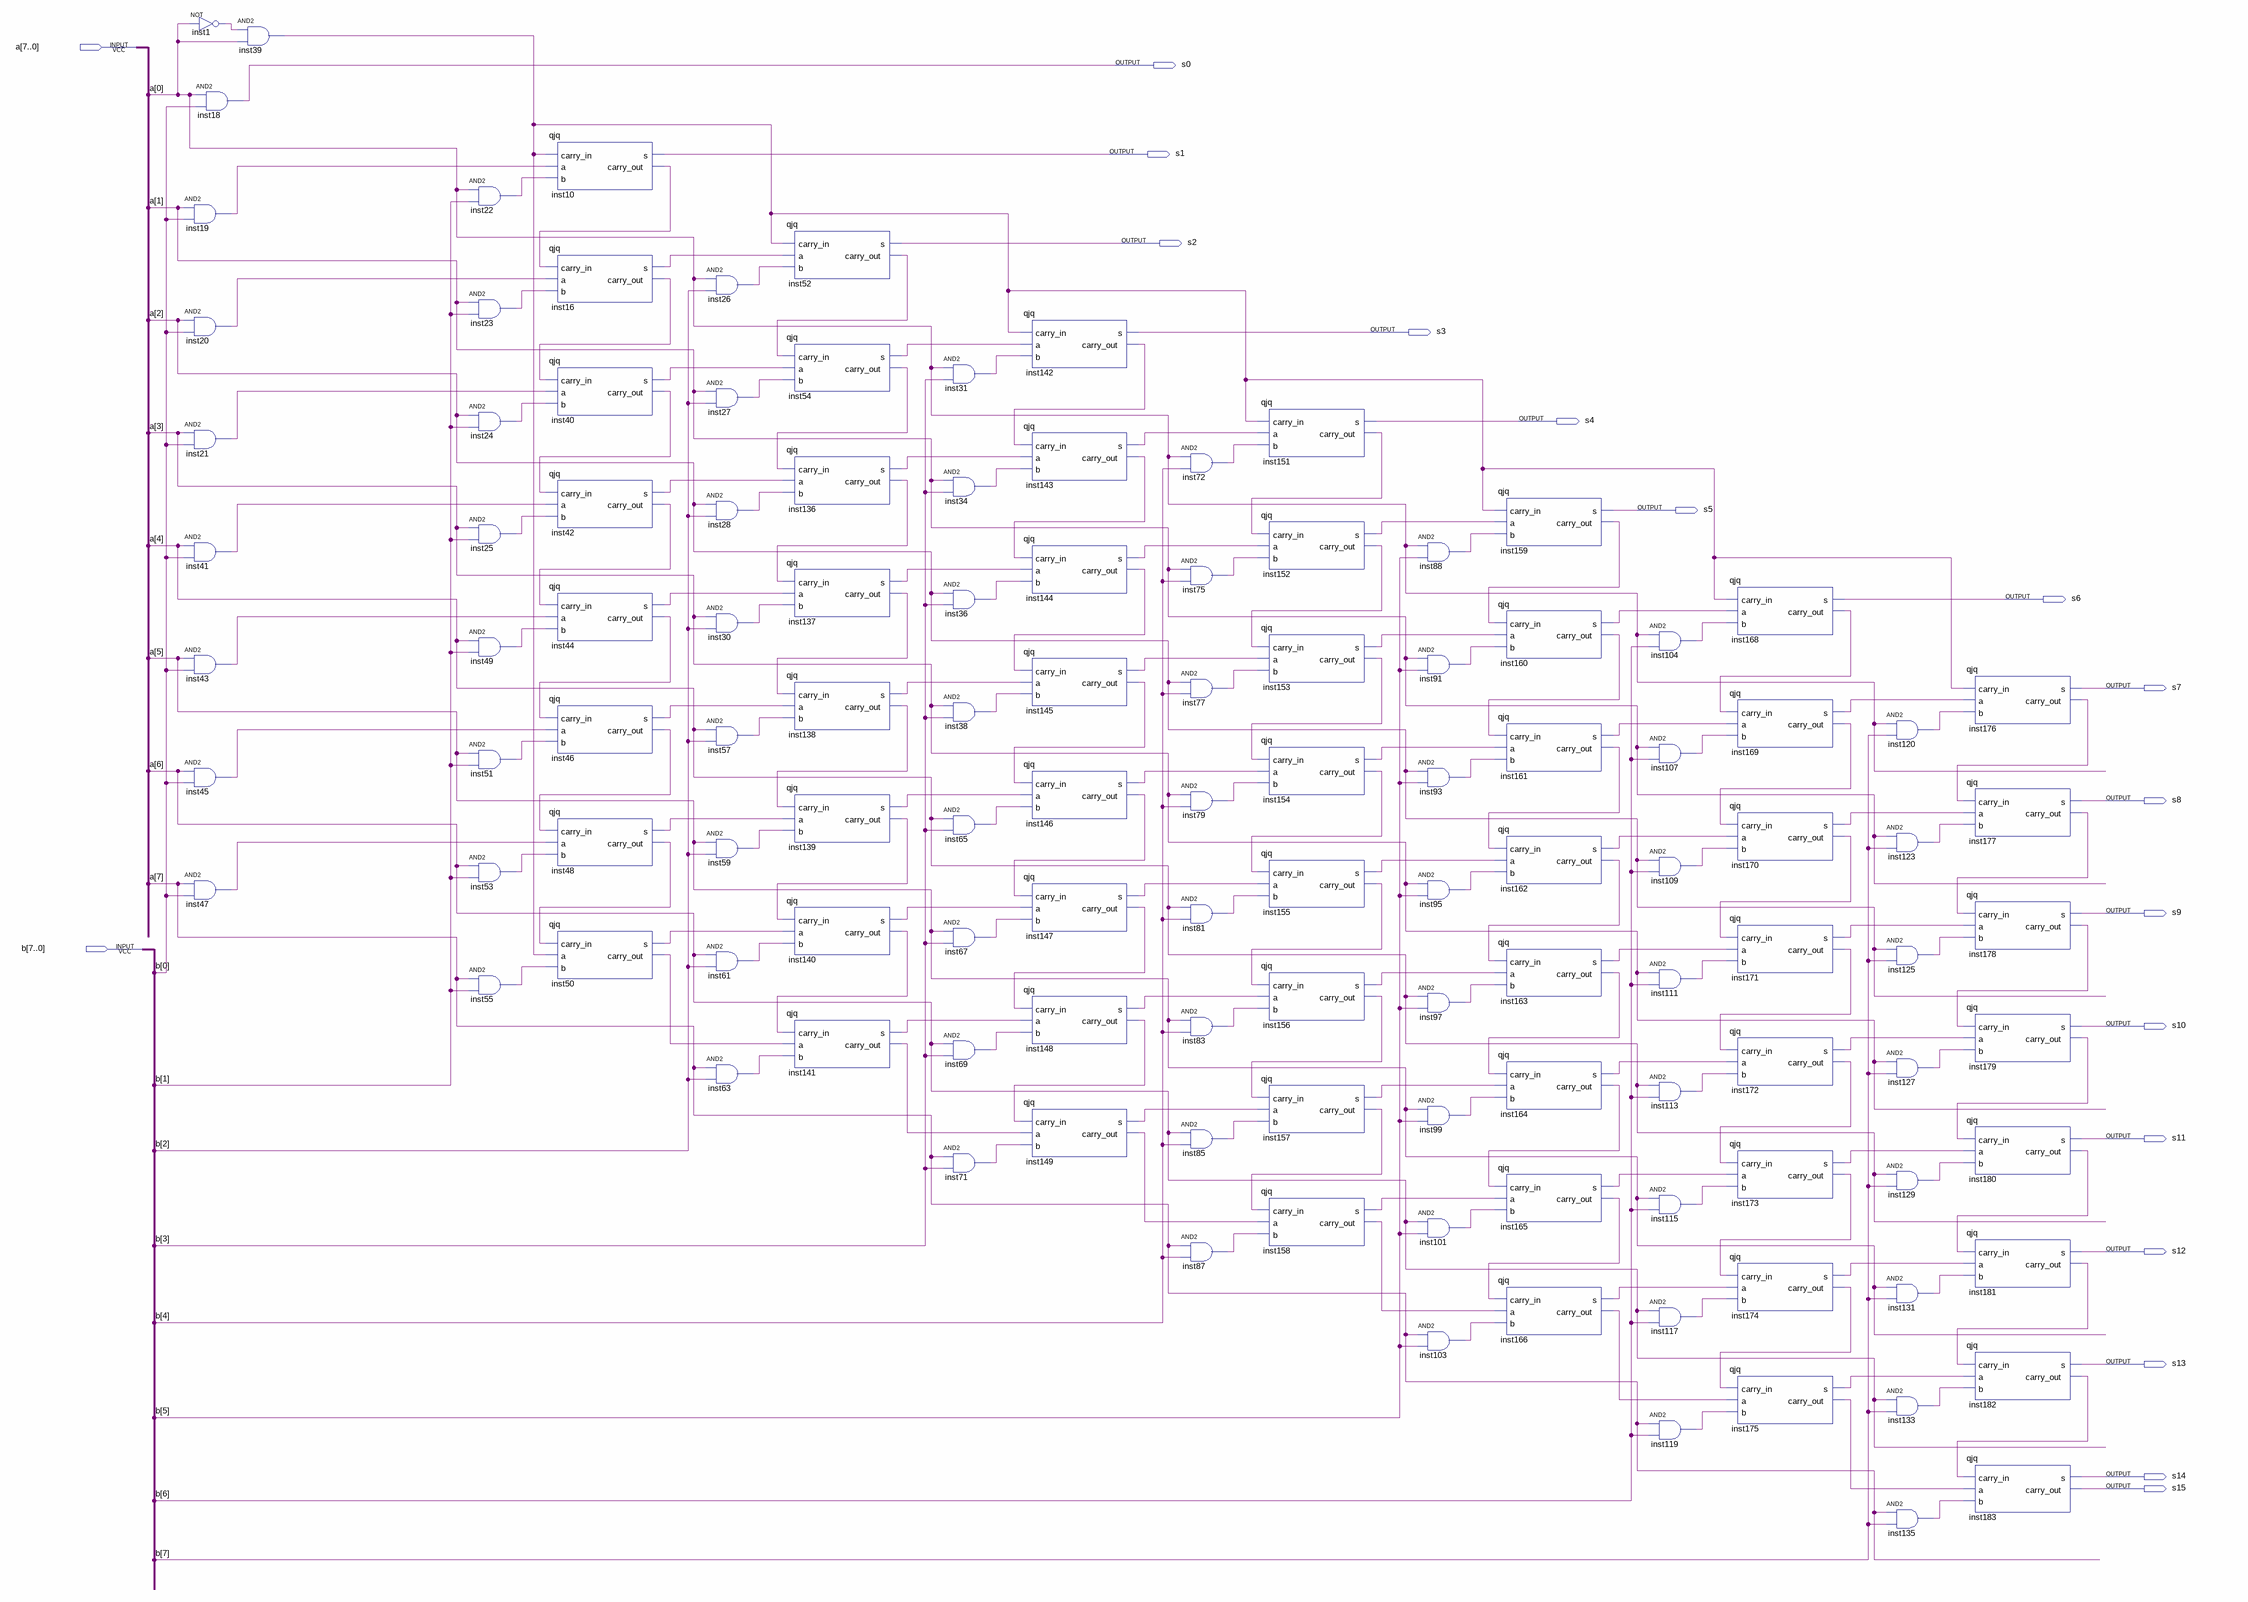
[diagram p0: schematic sheet]
// Quartus schematic wfhcfqx.bdf as structural Verilog: 122 symbols, 18 pins
module wfhcfqx (
  input  [7:0] a,
  input  [7:0] b,
  output s0,
  output s1,
  output s2,
  output s3,
  output s4,
  output s5,
  output s6,
  output s7,
  output s8,
  output s9,
  output s10,
  output s11,
  output s12,
  output s13,
  output s14,
  output s15
);

  wire inst1_out, inst10_carry_out, inst16_carry_out, inst16_s, inst19_out, inst20_out, inst21_out,
       inst22_out, inst23_out, inst24_out, inst25_out, inst26_out, inst27_out, inst28_out, inst30_out,
       inst31_out, inst34_out, inst36_out, inst38_out, inst39_out, inst40_carry_out, inst40_s, inst41_out,
       inst42_carry_out, inst42_s, inst43_out, inst44_carry_out, inst44_s, inst45_out, inst46_carry_out,
       inst46_s, inst47_out, inst48_carry_out, inst48_s, inst49_out, inst50_carry_out, inst50_s, inst51_out,
       inst52_carry_out, inst53_out, inst54_carry_out, inst54_s, inst55_out, inst57_out, inst59_out,
       inst61_out, inst63_out, inst65_out, inst67_out, inst69_out, inst71_out, inst72_out, inst75_out,
       inst77_out, inst79_out, inst81_out, inst83_out, inst85_out, inst87_out, inst88_out, inst91_out,
       inst93_out, inst95_out, inst97_out, inst99_out, inst101_out, inst103_out, inst104_out, inst107_out,
       inst109_out, inst111_out, inst113_out, inst115_out, inst117_out, inst119_out, inst120_out,
       inst123_out, inst125_out, inst127_out, inst129_out, inst131_out, inst133_out, inst135_out,
       inst136_carry_out, inst136_s, inst137_carry_out, inst137_s, inst138_carry_out, inst138_s,
       inst139_carry_out, inst139_s, inst140_carry_out, inst140_s, inst141_carry_out, inst141_s,
       inst142_carry_out, inst143_carry_out, inst143_s, inst144_carry_out, inst144_s, inst145_carry_out,
       inst145_s, inst146_carry_out, inst146_s, inst147_carry_out, inst147_s, inst148_carry_out, inst148_s,
       inst149_carry_out, inst149_s, inst151_carry_out, inst152_carry_out, inst152_s, inst153_carry_out,
       inst153_s, inst154_carry_out, inst154_s, inst155_carry_out, inst155_s, inst156_carry_out, inst156_s,
       inst157_carry_out, inst157_s, inst158_carry_out, inst158_s, inst159_carry_out, inst160_carry_out,
       inst160_s, inst161_carry_out, inst161_s, inst162_carry_out, inst162_s, inst163_carry_out, inst163_s,
       inst164_carry_out, inst164_s, inst165_carry_out, inst165_s, inst166_carry_out, inst166_s,
       inst168_carry_out, inst169_carry_out, inst169_s, inst170_carry_out, inst170_s, inst171_carry_out,
       inst171_s, inst172_carry_out, inst172_s, inst173_carry_out, inst173_s, inst174_carry_out, inst174_s,
       inst175_carry_out, inst175_s, inst176_carry_out, inst177_carry_out, inst178_carry_out,
       inst179_carry_out, inst180_carry_out, inst181_carry_out, inst182_carry_out;

  not inst1 (inst1_out, a[0]);
  and inst18 (s0, a[0], b[0]);
  and inst19 (inst19_out, a[1], b[0]);
  and inst20 (inst20_out, a[2], b[0]);
  and inst21 (inst21_out, a[3], b[0]);
  and inst41 (inst41_out, a[4], b[0]);
  and inst43 (inst43_out, a[5], b[0]);
  and inst45 (inst45_out, a[6], b[0]);
  and inst47 (inst47_out, a[7], b[0]);
  and inst39 (inst39_out, inst1_out, a[0]);
  and inst22 (inst22_out, a[0], b[1]);
  and inst23 (inst23_out, a[1], b[1]);
  and inst24 (inst24_out, a[2], b[1]);
  and inst25 (inst25_out, a[3], b[1]);
  and inst49 (inst49_out, a[4], b[1]);
  and inst51 (inst51_out, a[5], b[1]);
  and inst53 (inst53_out, a[6], b[1]);
  and inst55 (inst55_out, a[7], b[1]);
  qjq inst10 (.carry_in(inst39_out), .a(inst19_out), .b(inst22_out), .s(s1), .carry_out(inst10_carry_out));
  qjq inst16 (.carry_in(inst10_carry_out), .a(inst20_out), .b(inst23_out), .s(inst16_s), .carry_out(inst16_carry_out));
  qjq inst40 (.carry_in(inst16_carry_out), .a(inst21_out), .b(inst24_out), .s(inst40_s), .carry_out(inst40_carry_out));
  qjq inst42 (.carry_in(inst40_carry_out), .a(inst41_out), .b(inst25_out), .s(inst42_s), .carry_out(inst42_carry_out));
  qjq inst44 (.carry_in(inst42_carry_out), .a(inst43_out), .b(inst49_out), .s(inst44_s), .carry_out(inst44_carry_out));
  qjq inst46 (.carry_in(inst44_carry_out), .a(inst45_out), .b(inst51_out), .s(inst46_s), .carry_out(inst46_carry_out));
  qjq inst48 (.carry_in(inst46_carry_out), .a(inst47_out), .b(inst53_out), .s(inst48_s), .carry_out(inst48_carry_out));
  qjq inst50 (.carry_in(inst48_carry_out), .a(inst39_out), .b(inst55_out), .s(inst50_s), .carry_out(inst50_carry_out));
  and inst26 (inst26_out, a[0], b[2]);
  and inst27 (inst27_out, a[1], b[2]);
  and inst28 (inst28_out, a[2], b[2]);
  and inst30 (inst30_out, a[3], b[2]);
  and inst57 (inst57_out, a[4], b[2]);
  and inst59 (inst59_out, a[5], b[2]);
  and inst61 (inst61_out, a[6], b[2]);
  and inst63 (inst63_out, a[7], b[2]);
  qjq inst52 (.carry_in(inst39_out), .a(inst16_s), .b(inst26_out), .s(s2), .carry_out(inst52_carry_out));
  qjq inst54 (.carry_in(inst52_carry_out), .a(inst40_s), .b(inst27_out), .s(inst54_s), .carry_out(inst54_carry_out));
  qjq inst136 (.carry_in(inst54_carry_out), .a(inst42_s), .b(inst28_out), .s(inst136_s), .carry_out(inst136_carry_out));
  qjq inst137 (
    .carry_in(inst136_carry_out), .a(inst44_s), .b(inst30_out), .s(inst137_s), .carry_out(inst137_carry_out));
  qjq inst138 (
    .carry_in(inst137_carry_out), .a(inst46_s), .b(inst57_out), .s(inst138_s), .carry_out(inst138_carry_out));
  qjq inst139 (
    .carry_in(inst138_carry_out), .a(inst48_s), .b(inst59_out), .s(inst139_s), .carry_out(inst139_carry_out));
  qjq inst140 (
    .carry_in(inst139_carry_out), .a(inst50_s), .b(inst61_out), .s(inst140_s), .carry_out(inst140_carry_out));
  qjq inst141 (
    .carry_in(inst140_carry_out), .a(inst50_carry_out), .b(inst63_out), .s(inst141_s),
    .carry_out(inst141_carry_out));
  and inst31 (inst31_out, a[0], b[3]);
  and inst34 (inst34_out, a[1], b[3]);
  and inst36 (inst36_out, a[2], b[3]);
  and inst38 (inst38_out, a[3], b[3]);
  and inst65 (inst65_out, a[4], b[3]);
  and inst67 (inst67_out, a[5], b[3]);
  and inst69 (inst69_out, a[6], b[3]);
  and inst71 (inst71_out, a[7], b[3]);
  qjq inst142 (.carry_in(inst39_out), .a(inst54_s), .b(inst31_out), .s(s3), .carry_out(inst142_carry_out));
  qjq inst143 (
    .carry_in(inst142_carry_out), .a(inst136_s), .b(inst34_out), .s(inst143_s), .carry_out(inst143_carry_out));
  qjq inst144 (
    .carry_in(inst143_carry_out), .a(inst137_s), .b(inst36_out), .s(inst144_s), .carry_out(inst144_carry_out));
  qjq inst145 (
    .carry_in(inst144_carry_out), .a(inst138_s), .b(inst38_out), .s(inst145_s), .carry_out(inst145_carry_out));
  qjq inst146 (
    .carry_in(inst145_carry_out), .a(inst139_s), .b(inst65_out), .s(inst146_s), .carry_out(inst146_carry_out));
  qjq inst147 (
    .carry_in(inst146_carry_out), .a(inst140_s), .b(inst67_out), .s(inst147_s), .carry_out(inst147_carry_out));
  qjq inst148 (
    .carry_in(inst147_carry_out), .a(inst141_s), .b(inst69_out), .s(inst148_s), .carry_out(inst148_carry_out));
  qjq inst149 (
    .carry_in(inst148_carry_out), .a(inst141_carry_out), .b(inst71_out), .s(inst149_s),
    .carry_out(inst149_carry_out));
  and inst72 (inst72_out, a[0], b[4]);
  and inst75 (inst75_out, a[1], b[4]);
  and inst77 (inst77_out, a[2], b[4]);
  and inst79 (inst79_out, a[3], b[4]);
  and inst81 (inst81_out, a[4], b[4]);
  and inst83 (inst83_out, a[5], b[4]);
  and inst85 (inst85_out, a[6], b[4]);
  and inst87 (inst87_out, a[7], b[4]);
  qjq inst151 (.carry_in(inst39_out), .a(inst143_s), .b(inst72_out), .s(s4), .carry_out(inst151_carry_out));
  qjq inst152 (
    .carry_in(inst151_carry_out), .a(inst144_s), .b(inst75_out), .s(inst152_s), .carry_out(inst152_carry_out));
  qjq inst153 (
    .carry_in(inst152_carry_out), .a(inst145_s), .b(inst77_out), .s(inst153_s), .carry_out(inst153_carry_out));
  qjq inst154 (
    .carry_in(inst153_carry_out), .a(inst146_s), .b(inst79_out), .s(inst154_s), .carry_out(inst154_carry_out));
  qjq inst155 (
    .carry_in(inst154_carry_out), .a(inst147_s), .b(inst81_out), .s(inst155_s), .carry_out(inst155_carry_out));
  qjq inst156 (
    .carry_in(inst155_carry_out), .a(inst148_s), .b(inst83_out), .s(inst156_s), .carry_out(inst156_carry_out));
  qjq inst157 (
    .carry_in(inst156_carry_out), .a(inst149_s), .b(inst85_out), .s(inst157_s), .carry_out(inst157_carry_out));
  qjq inst158 (
    .carry_in(inst157_carry_out), .a(inst149_carry_out), .b(inst87_out), .s(inst158_s),
    .carry_out(inst158_carry_out));
  and inst88 (inst88_out, a[0], b[5]);
  and inst91 (inst91_out, a[1], b[5]);
  and inst93 (inst93_out, a[2], b[5]);
  and inst95 (inst95_out, a[3], b[5]);
  and inst97 (inst97_out, a[4], b[5]);
  and inst99 (inst99_out, a[5], b[5]);
  and inst101 (inst101_out, a[6], b[5]);
  and inst103 (inst103_out, a[7], b[5]);
  qjq inst159 (.carry_in(inst39_out), .a(inst152_s), .b(inst88_out), .s(s5), .carry_out(inst159_carry_out));
  qjq inst160 (
    .carry_in(inst159_carry_out), .a(inst153_s), .b(inst91_out), .s(inst160_s), .carry_out(inst160_carry_out));
  qjq inst161 (
    .carry_in(inst160_carry_out), .a(inst154_s), .b(inst93_out), .s(inst161_s), .carry_out(inst161_carry_out));
  qjq inst162 (
    .carry_in(inst161_carry_out), .a(inst155_s), .b(inst95_out), .s(inst162_s), .carry_out(inst162_carry_out));
  qjq inst163 (
    .carry_in(inst162_carry_out), .a(inst156_s), .b(inst97_out), .s(inst163_s), .carry_out(inst163_carry_out));
  qjq inst164 (
    .carry_in(inst163_carry_out), .a(inst157_s), .b(inst99_out), .s(inst164_s), .carry_out(inst164_carry_out));
  qjq inst165 (
    .carry_in(inst164_carry_out), .a(inst158_s), .b(inst101_out), .s(inst165_s), .carry_out(inst165_carry_out));
  qjq inst166 (
    .carry_in(inst165_carry_out), .a(inst158_carry_out), .b(inst103_out), .s(inst166_s),
    .carry_out(inst166_carry_out));
  and inst104 (inst104_out, a[0], b[6]);
  and inst107 (inst107_out, a[1], b[6]);
  and inst109 (inst109_out, a[2], b[6]);
  and inst111 (inst111_out, a[3], b[6]);
  and inst113 (inst113_out, a[4], b[6]);
  and inst115 (inst115_out, a[5], b[6]);
  and inst117 (inst117_out, a[6], b[6]);
  and inst119 (inst119_out, a[7], b[6]);
  qjq inst168 (.carry_in(inst39_out), .a(inst160_s), .b(inst104_out), .s(s6), .carry_out(inst168_carry_out));
  qjq inst169 (
    .carry_in(inst168_carry_out), .a(inst161_s), .b(inst107_out), .s(inst169_s), .carry_out(inst169_carry_out));
  qjq inst170 (
    .carry_in(inst169_carry_out), .a(inst162_s), .b(inst109_out), .s(inst170_s), .carry_out(inst170_carry_out));
  qjq inst171 (
    .carry_in(inst170_carry_out), .a(inst163_s), .b(inst111_out), .s(inst171_s), .carry_out(inst171_carry_out));
  qjq inst172 (
    .carry_in(inst171_carry_out), .a(inst164_s), .b(inst113_out), .s(inst172_s), .carry_out(inst172_carry_out));
  qjq inst173 (
    .carry_in(inst172_carry_out), .a(inst165_s), .b(inst115_out), .s(inst173_s), .carry_out(inst173_carry_out));
  qjq inst174 (
    .carry_in(inst173_carry_out), .a(inst166_s), .b(inst117_out), .s(inst174_s), .carry_out(inst174_carry_out));
  qjq inst175 (
    .carry_in(inst174_carry_out), .a(inst166_carry_out), .b(inst119_out), .s(inst175_s),
    .carry_out(inst175_carry_out));
  and inst120 (inst120_out, a[0], b[7]);
  and inst123 (inst123_out, a[1], b[7]);
  and inst125 (inst125_out, a[2], b[7]);
  and inst127 (inst127_out, a[3], b[7]);
  and inst129 (inst129_out, a[4], b[7]);
  and inst131 (inst131_out, a[5], b[7]);
  and inst133 (inst133_out, a[6], b[7]);
  and inst135 (inst135_out, a[7], b[7]);
  qjq inst176 (.carry_in(inst39_out), .a(inst169_s), .b(inst120_out), .s(s7), .carry_out(inst176_carry_out));
  qjq inst177 (.carry_in(inst176_carry_out), .a(inst170_s), .b(inst123_out), .s(s8), .carry_out(inst177_carry_out));
  qjq inst178 (.carry_in(inst177_carry_out), .a(inst171_s), .b(inst125_out), .s(s9), .carry_out(inst178_carry_out));
  qjq inst179 (.carry_in(inst178_carry_out), .a(inst172_s), .b(inst127_out), .s(s10), .carry_out(inst179_carry_out));
  qjq inst180 (.carry_in(inst179_carry_out), .a(inst173_s), .b(inst129_out), .s(s11), .carry_out(inst180_carry_out));
  qjq inst181 (.carry_in(inst180_carry_out), .a(inst174_s), .b(inst131_out), .s(s12), .carry_out(inst181_carry_out));
  qjq inst182 (.carry_in(inst181_carry_out), .a(inst175_s), .b(inst133_out), .s(s13), .carry_out(inst182_carry_out));
  qjq inst183 (.carry_in(inst182_carry_out), .a(inst175_carry_out), .b(inst135_out), .s(s14), .carry_out(s15));
endmodule
